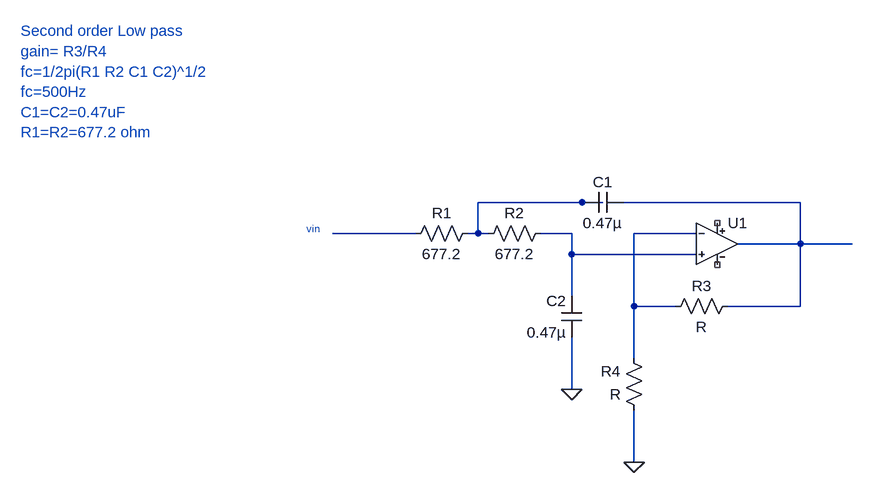
[diagram p0: schematic low pass.asc]
low pass.asc, the LTspice schematic file:
Version 4
SHEET 1 880 680
WIRE -1136 112 -1296 112
WIRE -1104 112 -1136 112
WIRE -800 112 -1072 112
WIRE -1392 160 -1520 160
WIRE -1296 160 -1296 112
WIRE -1296 160 -1312 160
WIRE -1280 160 -1296 160
WIRE -1152 160 -1200 160
WIRE -960 160 -1056 160
WIRE -800 176 -800 112
WIRE -800 176 -896 176
WIRE -720 176 -800 176
WIRE -1152 192 -1152 160
WIRE -960 192 -1152 192
WIRE -1152 256 -1152 192
WIRE -1056 272 -1056 160
WIRE -992 272 -1056 272
WIRE -800 272 -800 176
WIRE -800 272 -912 272
WIRE -1056 352 -1056 272
WIRE -1152 400 -1152 320
WIRE -1056 512 -1056 432
FLAG -1152 400 0
FLAG -1056 512 0
SYMBOL res -1296 144 R90
WINDOW 0 0 56 VBottom 2
WINDOW 3 32 56 VTop 2
SYMATTR InstName R1
SYMATTR Value 677.2
SYMBOL res -1184 144 R90
WINDOW 0 0 56 VBottom 2
WINDOW 3 32 56 VTop 2
SYMATTR InstName R2
SYMATTR Value 677.2
SYMBOL res -896 256 R90
WINDOW 0 0 56 VBottom 2
WINDOW 3 32 56 VTop 2
SYMATTR InstName R3
SYMBOL res -1040 448 R180
WINDOW 0 36 76 Left 2
WINDOW 3 36 40 Left 2
SYMATTR InstName R4
SYMBOL cap -1072 96 R90
WINDOW 0 0 32 VBottom 2
WINDOW 3 32 32 VTop 2
SYMATTR InstName C1
SYMATTR Value 0.47µ
SYMBOL cap -1136 320 R180
WINDOW 0 24 56 Left 2
WINDOW 3 24 8 Left 2
SYMATTR InstName C2
SYMATTR Value 0.47µ
SYMBOL TL074 -928 176 R0
SYMATTR InstName U1
TEXT -1560 152 Left 1 ;vin
TEXT -2000 -152 Left 2 ;Second order Low pass   \ngain= R3/R4\nfc=1/2pi(R1 R2 C1 C2)^1/2\nfc=500Hz\nC1=C2=0.47uF\nR1=R2=677.2 ohm

The netlist it stands for:
* low pass.asc
R1 N001 N003 677.2
R2 N004 N001 677.2
R3 N002 N005 R
R4 0 N005 R
C1 N002 N001 0.47µ
C2 0 N004 0.47µ
XU1 N004 N005 NC_01 NC_02 N002 TL074  ; pins In+ In- V+ V- OUT
* vin
* Second order Low pass
* gain= R3/R4
* fc=1/2pi(R1 R2 C1 C2)^1/2
* fc=500Hz
* C1=C2=0.47uF
* R1=R2=677.2 ohm
.lib C:\Users\thusa.THUSA\Downloads\sloj068\TL074.301
.backanno
.end